# EAGLE design SparkFun_On_Screen_Display-MAX7456 (EAGLE 7.2.0)
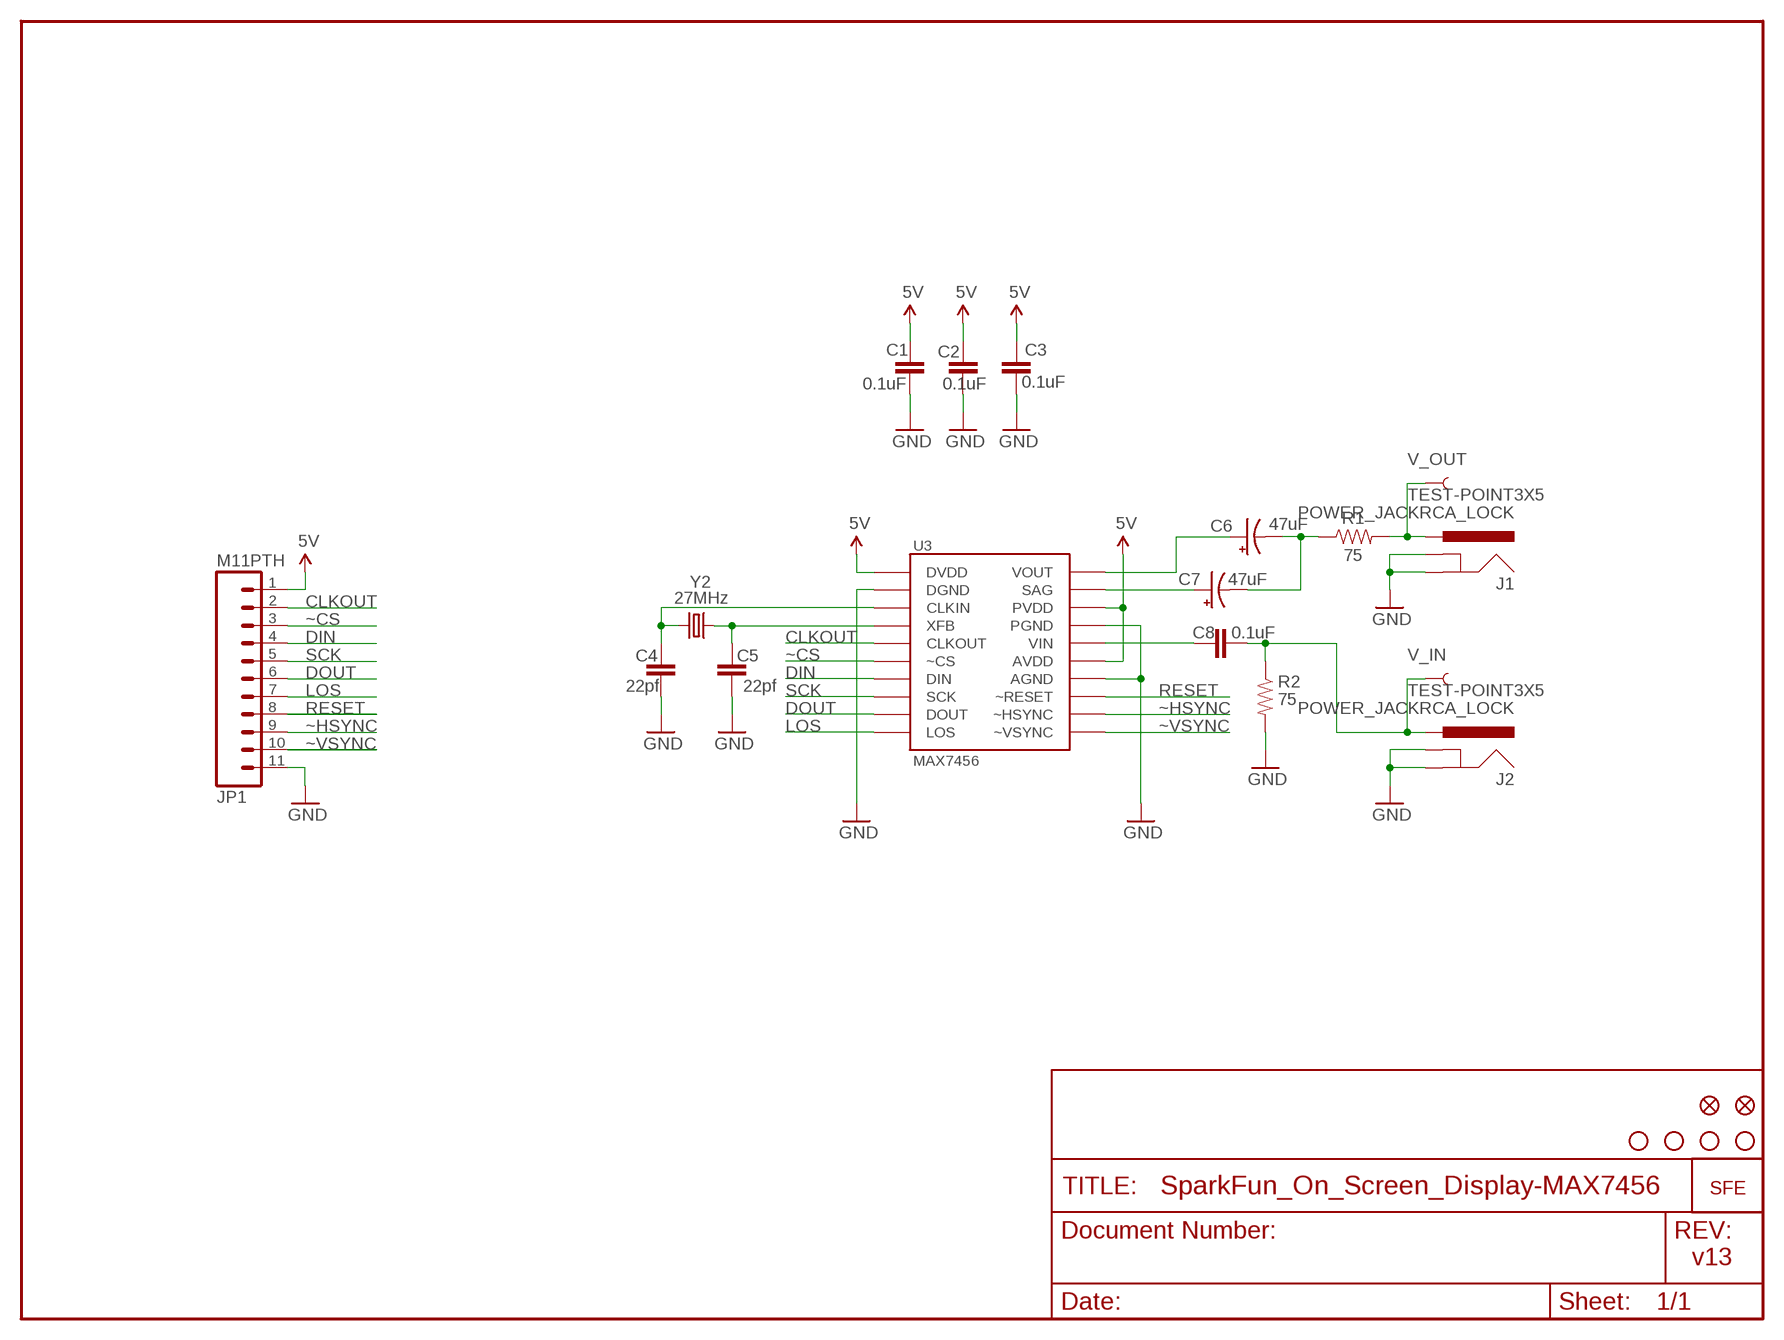
[diagram p0: schematic, sheet 1]

## Parts
C1  0.1uF  CAP0402  [C0402]
C2  0.1uF  CAP0402  [C0402]
C3  0.1uF  CAP0402  [C0402]
C4  22pf  CAP0402  [C0402]
C5  22pf  CAP0402  [C0402]
C6  47uF  CAP_POL3528  [EIA3528]
C7  47uF  CAP_POL3528  [EIA3528]
C8  0.1uF  CAP0402  [C0402]
J1  POWER_JACKRCA_LOCK  [RCA_LOCK]
J2  POWER_JACKRCA_LOCK  [RCA_LOCK]
JP1  M11PTH  [1X11]
R1  75  RESISTOR0402  [C0402]
R2  75  RESISTOR0402  [C0402]
U3  MAX7456  [TSSOP28]
U$2  STAND-OFF  [STAND-OFF]
U$8  LOGO-SFENEW  [SFE-NEW-WEBLOGO]
U$9  FIDUCIAL1X2  [FIDUCIAL-1X2]
U$10  FIDUCIAL1X2  [FIDUCIAL-1X2]
U$12  STAND-OFF  [STAND-OFF]
U$13  STAND-OFF  [STAND-OFF]
U$14  STAND-OFF  [STAND-OFF]
V_IN  TEST-POINT3X5  [PAD.03X.05]
V_OUT  TEST-POINT3X5  [PAD.03X.05]
Y2  27MHz  CRYSTAL5X3  [CRYSTAL-SMD-5X3]

## Nets
5V: C1.2 C2.2 C3.2 JP1.1 U3.3(DVDD) U3.21(AVDD) U3.24(PVDD)
CLKOUT: JP1.2 U3.7(CLKOUT)
DIN: JP1.4 U3.9(DIN)
DOUT: JP1.6 U3.11(DOUT)
GND: C1.1 C2.1 C3.1 C4.1 C5.1 J1.BARREL(GND) J1.SPRING(GNDBREAK) J2.BARREL(GND) J2.SPRING(GNDBREAK) JP1.11 R2.2 U3.4(DGND) U3.20(AGND) U3.23(PGND)
LOS: JP1.7 U3.12(LOS)
N$1: C4.2 U3.5(CLKIN) Y2.3
N$4: C5.2 U3.6(XFB) Y2.1
N$5: C6.C(-) C7.C(-) R1.1
N$6: C7.A(+) U3.25(SAG)
N$7: C6.A(+) U3.26(VOUT)
N$8: J1.BREAK(PWR) R1.2 V_OUT.P$1
N$9: C8.2 U3.22(VIN)
N$10: C8.1 J2.BREAK(PWR) R2.1 V_IN.P$1
RESET: JP1.8 U3.19(~RESET)
SCK: JP1.5 U3.10(SCK)
~CS: JP1.3 U3.8(~CS)
~HSYNC: JP1.9 U3.18(~HSYNC)
~VSYNC: JP1.10 U3.17(~VSYNC)

## Notes on the sheet
- v13

## Library data of the parts
C1-C5 C8 = SparkFun:CAP: Capacitor Standard 0603 ceramic capacitor, and 0.1" leaded capacitor.
C6 C7 = SparkFun:CAP_POL: Capacitor Polarized These are standard SMD and PTH capacitors. Normally 10uF, 47uF, and 100uF in electrolytic and tantalum varieties. Always verify the external diameter of the through hole cap, it varies with capacity, voltage, and manufacturer. The EIA devices should be standard.
J1 J2 = SparkFun:POWER_JACK: Power Jack This is the standard 5.5mm barrel jack for power. The PTH is the most common, proven, reliable, footprint. All others are experimental. The Slot footprint only works if the mill layer is transmitted to the PCB fab house so be warned. Spark Fun Electronics SKU : PRT-00119. Mating wall wart : TOL-00298 (and others)
JP1 = SparkFun:M11: Header 11 Standard 11-pin 0.1" header. Use with straight break away headers (SKU : PRT-00116), right angle break away headers (PRT-00553), swiss pins (PRT-00743), machine pins (PRT-00117), and female headers (PRT-00115).
R1 R2 = SparkFun:RESISTOR: Resistor Basic schematic elements and footprints for 0603, 1206, and PTH 1/10th watt (small) resistors.
U3 = SparkFun:MAX7456
U$2 U$12-U$14 = SparkFun:STAND-OFF: Stand Off This is the mechanical footprint for a #4 phillips button head screw. Use the keepout ring to avoid running the screw head into surrounding components. SKU : PRT-00447
U$8 = SparkFun:LOGO-SFE: Spark Fun Electronics PCB Logo This is the standard Spark Fun Electronics PCB logo.
U$9 U$10 = SparkFun:FIDUCIAL: Fiducial Alignment Points Various fiducial points for machine vision alignment.
V_IN V_OUT = SparkFun:TEST-POINT
Y2 = SparkFun:CRYSTAL: Crystals Various standard crystals. Proven footprints. Spark Fun Electronics SKU : COM-00534

## Board
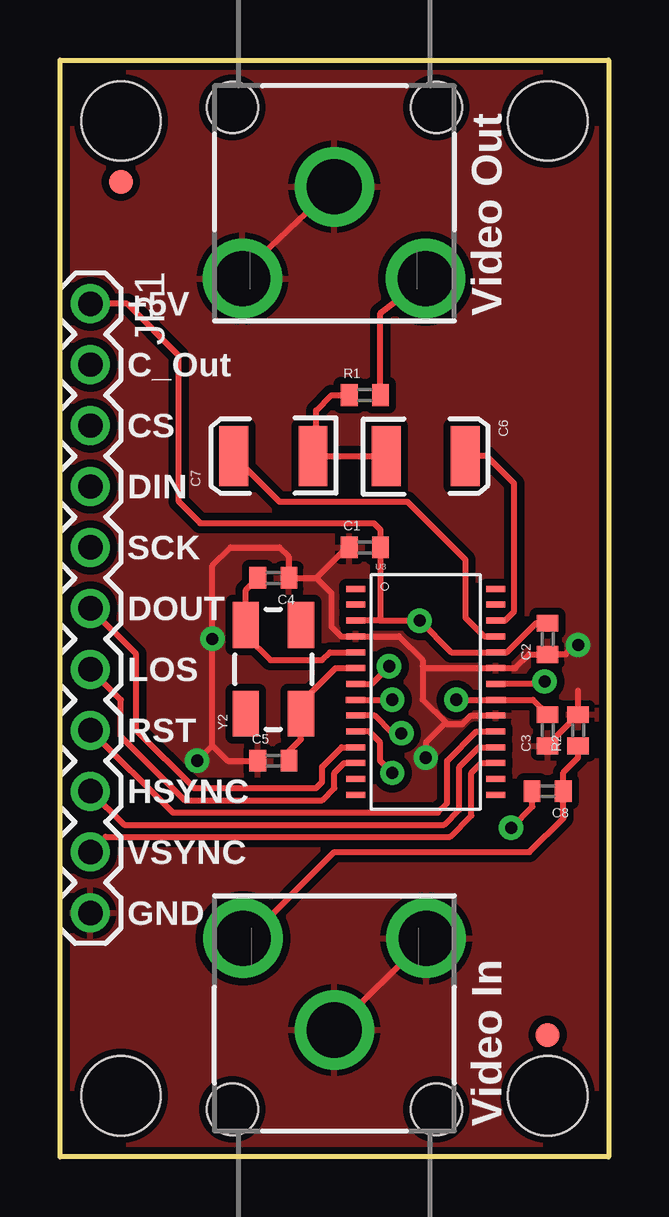
[diagram p1: board, top side]
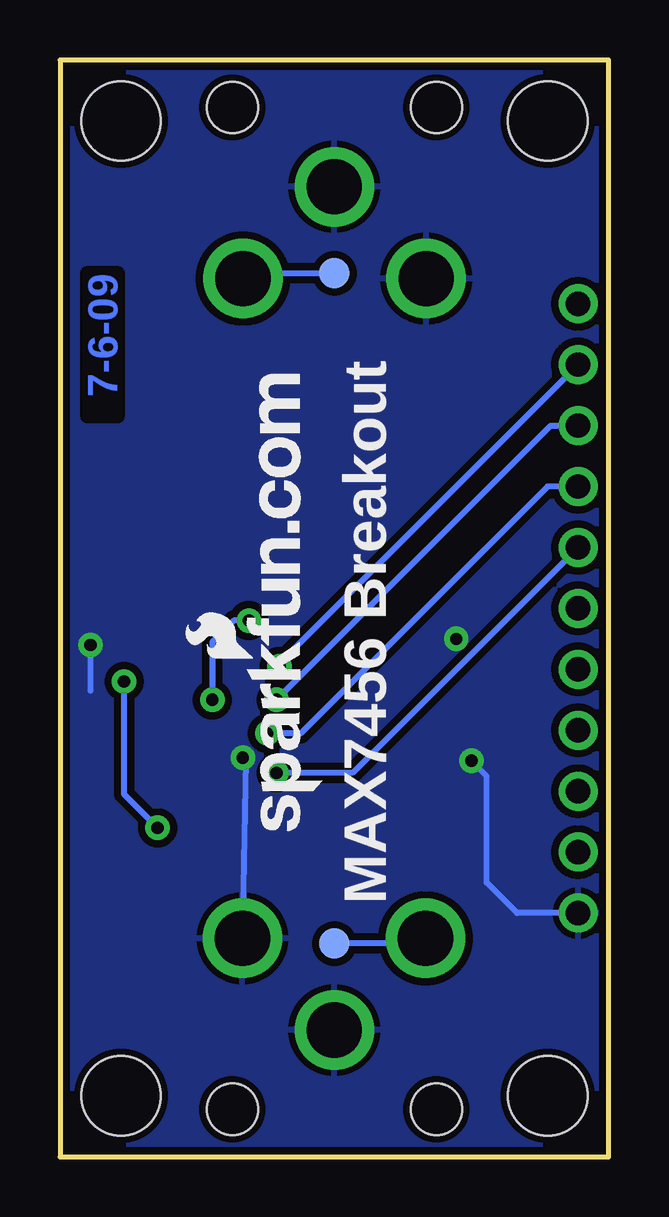
[diagram p2: board, bottom side, seen from below]

Size 22.86 x 45.72 mm. Coordinates in mm from the lower left corner, seen from the top.
Outline: 0,0 0,45.72 22.86,45.72 22.86,0 0,0
Copper layers (1*16): Top 0.035mm / dielectric 1.5mm / Bottom 0.035mm
Design rules "SparkFun": minimum track width 8mil, minimum drill 20mil, track to track 8mil, track to pad 8mil, pad to pad 8mil, via to via 8mil, smd to smd 8mil, copper to edge 10mil, drill to drill 8mil, minimum pad ring 12mil, minimum via ring 10mil, stop-mask expansion 4mil, vias tented up to drill 25mil, thermal gap 10mil

### Footprints (pad centres in the part's own frame; a part is rotated, then mirrored left to right if it is on the bottom)
C0402 = smd 0.7 x 0.9: 1 -0.65,0; 2 0.65,0
EIA3528 = smd 1.2 x 2.5: A 1.65,0; C -1.65,0
RCA_LOCK = drill 2.3: BARREL 0.203,0; BREAK 4.03,3.802; SPRING 4.03,-3.827 | hole 2.134: -3.1,4.25; -3.1,-4.25
1X11 = drill 1.016: 1 0,0; 2 2.54,0; 3 5.08,0; 4 7.62,0; 5 10.16,0; 6 12.7,0; 7 15.24,0; 8 17.78,0; 9 20.32,0; 10 22.86,0; 11 25.4,0
TSSOP28 = smd 0.8 x 0.25: 1 -2.921,4.623; 2 -2.921,3.962; 3 -2.921,3.302; 4 -2.921,2.642; 5 -2.921,1.981; 6 -2.921,1.321; 7 -2.921,0.66; 8 -2.927,0; 9 -2.921,-0.66; 10 -2.921,-1.321; 11 -2.921,-1.981; 12 -2.921,-2.642; 13 -2.921,-3.302; 14 -2.921,-3.962; 15 2.921,-3.962; 16 2.921,-3.302; 17 2.921,-2.642; 18 2.921,-1.981; 19 2.921,-1.321; 20 2.921,-0.66; 21 2.927,0; 22 2.921,0.66; 23 2.921,1.321; 24 2.921,1.981; 25 2.921,2.642; 26 2.921,3.302; 27 2.921,3.962; 28 2.921,4.623
STAND-OFF = hole 3.302: 0,0
FIDUCIAL-1X2 = smd 1 x 1: 1 0,0
PAD.03X.05 = smd 1.27 x 1.27: P$1 0,0
CRYSTAL-SMD-5X3 = smd 1.9 x 1.1: 1 -1.85,-1.15; 2 1.85,-1.15; 3 1.85,1.15; 4 -1.85,1.15

### Placement (x,y rotation side)
C1  12.7,25.4 0 top
C2  20.32,21.59 90 top
C3  20.32,17.78 90 top
C4  8.89,24.13 180 top
C5  8.89,16.51 0 top
C6  15.24,29.21 0 top
C7  8.89,29.21 180 top
C8  20.32,15.24 180 top
J1  11.43,40.64 270 top
J2  11.43,5.08 90 top
JP1  1.27,35.56 270 top
R1  12.7,31.75 0 top
R2  21.59,17.78 90 top
U3  15.24,19.05 0 top
U$2  20.32,43.18 0 top
U$8  11.94,13.59 90 bottom
U$9  20.32,5.08 0 top
U$10  2.54,40.64 0 top
U$12  2.54,43.18 0 top
U$13  20.32,2.54 0 top
U$14  2.54,2.54 0 top
V_IN  11.43,8.89 0 bottom
V_OUT  11.43,36.83 0 bottom
Y2  8.89,20.32 90 top

### Tracks (layer width: path | path; a pad name or v marks a point on that pad's centre or on a via)
5V  (via drill 0.51)
  Top 0.254: 13.34,22.35 U3.3 | 13.34,22.35 13.35,22.37 C1.2 13.35,26.15 13.08,26.42 5.84,26.42 4.95,27.3 4.95,33.4 2.79,35.56 JP1.1 | C2.2 19.83,22.24 18.62,21.03 U3.24 16.31,21.03 v14.99,22.35 13.34,22.35 | v16.51,19.05 U3.21 19.7,19.05 C3.2
  Bottom 0.254: v14.99,22.35 15.62,22.35 16.51,21.46 v16.51,19.05
CLKOUT  (via drill 0.51)
  Top 0.254: U3.7 12.98,19.71 v13.72,20.45
  Bottom 0.254: v13.72,20.45 13.72,20.57 JP1.2
DIN  (via drill 0.51)
  Top 0.254: U3.9 13.11,18.39 13.84,17.65 v14.22,17.65
  Bottom 0.254: v14.22,17.65 12.83,17.65 2.54,27.94 JP1.4
DOUT
  Top 0.254: U3.11 11.73,17.07 10.92,16.26 10.92,15.62 10.67,15.37 5.59,15.37 3.17,17.78 3.17,20.95 JP1.6
GND  (via drill 0.51)
  Top 0.254: 21.59,19.43 R2.2 20.32,17.16 C3.1 | v21.59,21.34 21.46,21.34 21.08,20.95 20.34,20.95 C2.1 19.54,20.94 18.97,20.37 U3.23 15.19,20.37 15.11,20.45 | 10.67,24.13 C4.1 9.53,24.14 9.53,25.02 9.14,25.4 7.11,25.4 6.35,24.64 v6.35,21.59 6.35,17.14 | 10.67,24.13 11.3,23.5 11.3,22.1 11.71,21.69 U3.4 14.12,21.69 15.11,20.7 15.11,20.45 | C1.1 11.94,25.4 10.67,24.13 | C5.1 6.99,16.51 6.35,17.14 | U3.20 17.12,18.39 16.76,18.03 16.13,18.03 16.07,18.1 | J2.SPRING J2.BARREL | 7.62,36.83 J1.BARREL | 15.11,20.45 15.11,19.05 16.07,18.1 | v15.24,16.64 15.24,17.27 16.07,18.1 | v5.71,16.51 6.35,17.14
  Bottom 0.254: v21.59,21.34 21.59,19.43 | J2.SPRING 15.13,16.53 v15.24,16.64 | JP1.11 3.81,10.16 5.08,11.43 5.08,15.88 v5.71,16.51
  pour Top (isolate 0.305): 0,0 22.86,0 22.86,45.72 0,45.72
  pour Bottom (isolate 0.305): 0,0 22.86,0 22.86,45.72 0,45.72
LOS
  Top 0.254: U3.12 11.84,16.41 11.43,16 11.43,15.37 10.92,14.86 5.21,14.86 2.54,17.53 2.54,19.05 JP1.7
N$1
  Top 0.254: U3.5 11.25,21.03 10.92,20.7 8.76,20.7 7.75,21.72 Y2.3 7.74,23.63 C4.2
N$4
  Top 0.254: C5.2 9.54,16.91 10.04,17.41 Y2.1 10.03,18.92 11.48,20.37 U3.6
N$5
  Top 0.254: C6.C C7.C 10.67,29.34 10.67,31.11 11.3,31.75 R1.1
N$6
  Top 0.254: U3.25 17.68,21.69 16.89,22.48 16.89,24.89 14.48,27.3 9.14,27.3 C7.A
N$7
  Top 0.254: U3.26 18.54,22.35 18.92,22.73 18.92,28.07 17.78,29.21 C6.A
N$8
  Top 0.254: R1.2 13.35,35.16 J1.BREAK
  Bottom 0.254: V_OUT.P$1 15.01,36.83 J1.BREAK
N$9  (via drill 0.51)
  Top 0.254: U3.22 20.09,19.71 v20.19,19.81 | v18.8,13.72 19.68,14.61 19.68,15.22 C8.2
  Bottom 0.254: v20.19,19.81 20.19,15.11 v18.8,13.72
N$10
  Top 0.254: J2.BREAK 7.73,9 11.43,12.7 19.56,12.7 20.97,14.11 C8.1 20.97,16.02 21.59,16.64 R2.1
  Bottom 0.254: V_IN.P$1 7.85,8.89 J2.BREAK
RESET
  Top 0.254: U3.19 17.35,17.73 16.13,16.51 16.13,14.73 15.75,14.35 4.7,14.35 JP1.8
SCK  (via drill 0.51)
  Top 0.254: U3.10 12.88,17.73 13.34,17.27 13.34,16.51 v13.84,16
  Bottom 0.254: v13.84,16 10.67,16 JP1.5
~CS  (via drill 0.51)
  Top 0.254: U3.8 v13.84,19.05
  Bottom 0.254: v13.84,19.05 2.41,30.48 JP1.3
~HSYNC
  Top 0.254: U3.18 17.45,17.07 16.64,16.26 16.64,14.48 16,13.84 2.67,13.84 JP1.9
~VSYNC
  Top 0.254: U3.17 17.55,16.41 17.14,16 17.14,14.22 16.26,13.34 1.91,13.34 JP1.10

### Text on the board
Bottom: 7-6-09
tPlace: +5V | Video Out | C_Out | CS | DIN | SCK | DOUT | LOS | RST | HSYNC | VSYNC | GND | Video In
bPlace: MAX7456 Breakout